# EAGLE design pcb (EAGLE 8.5.0)
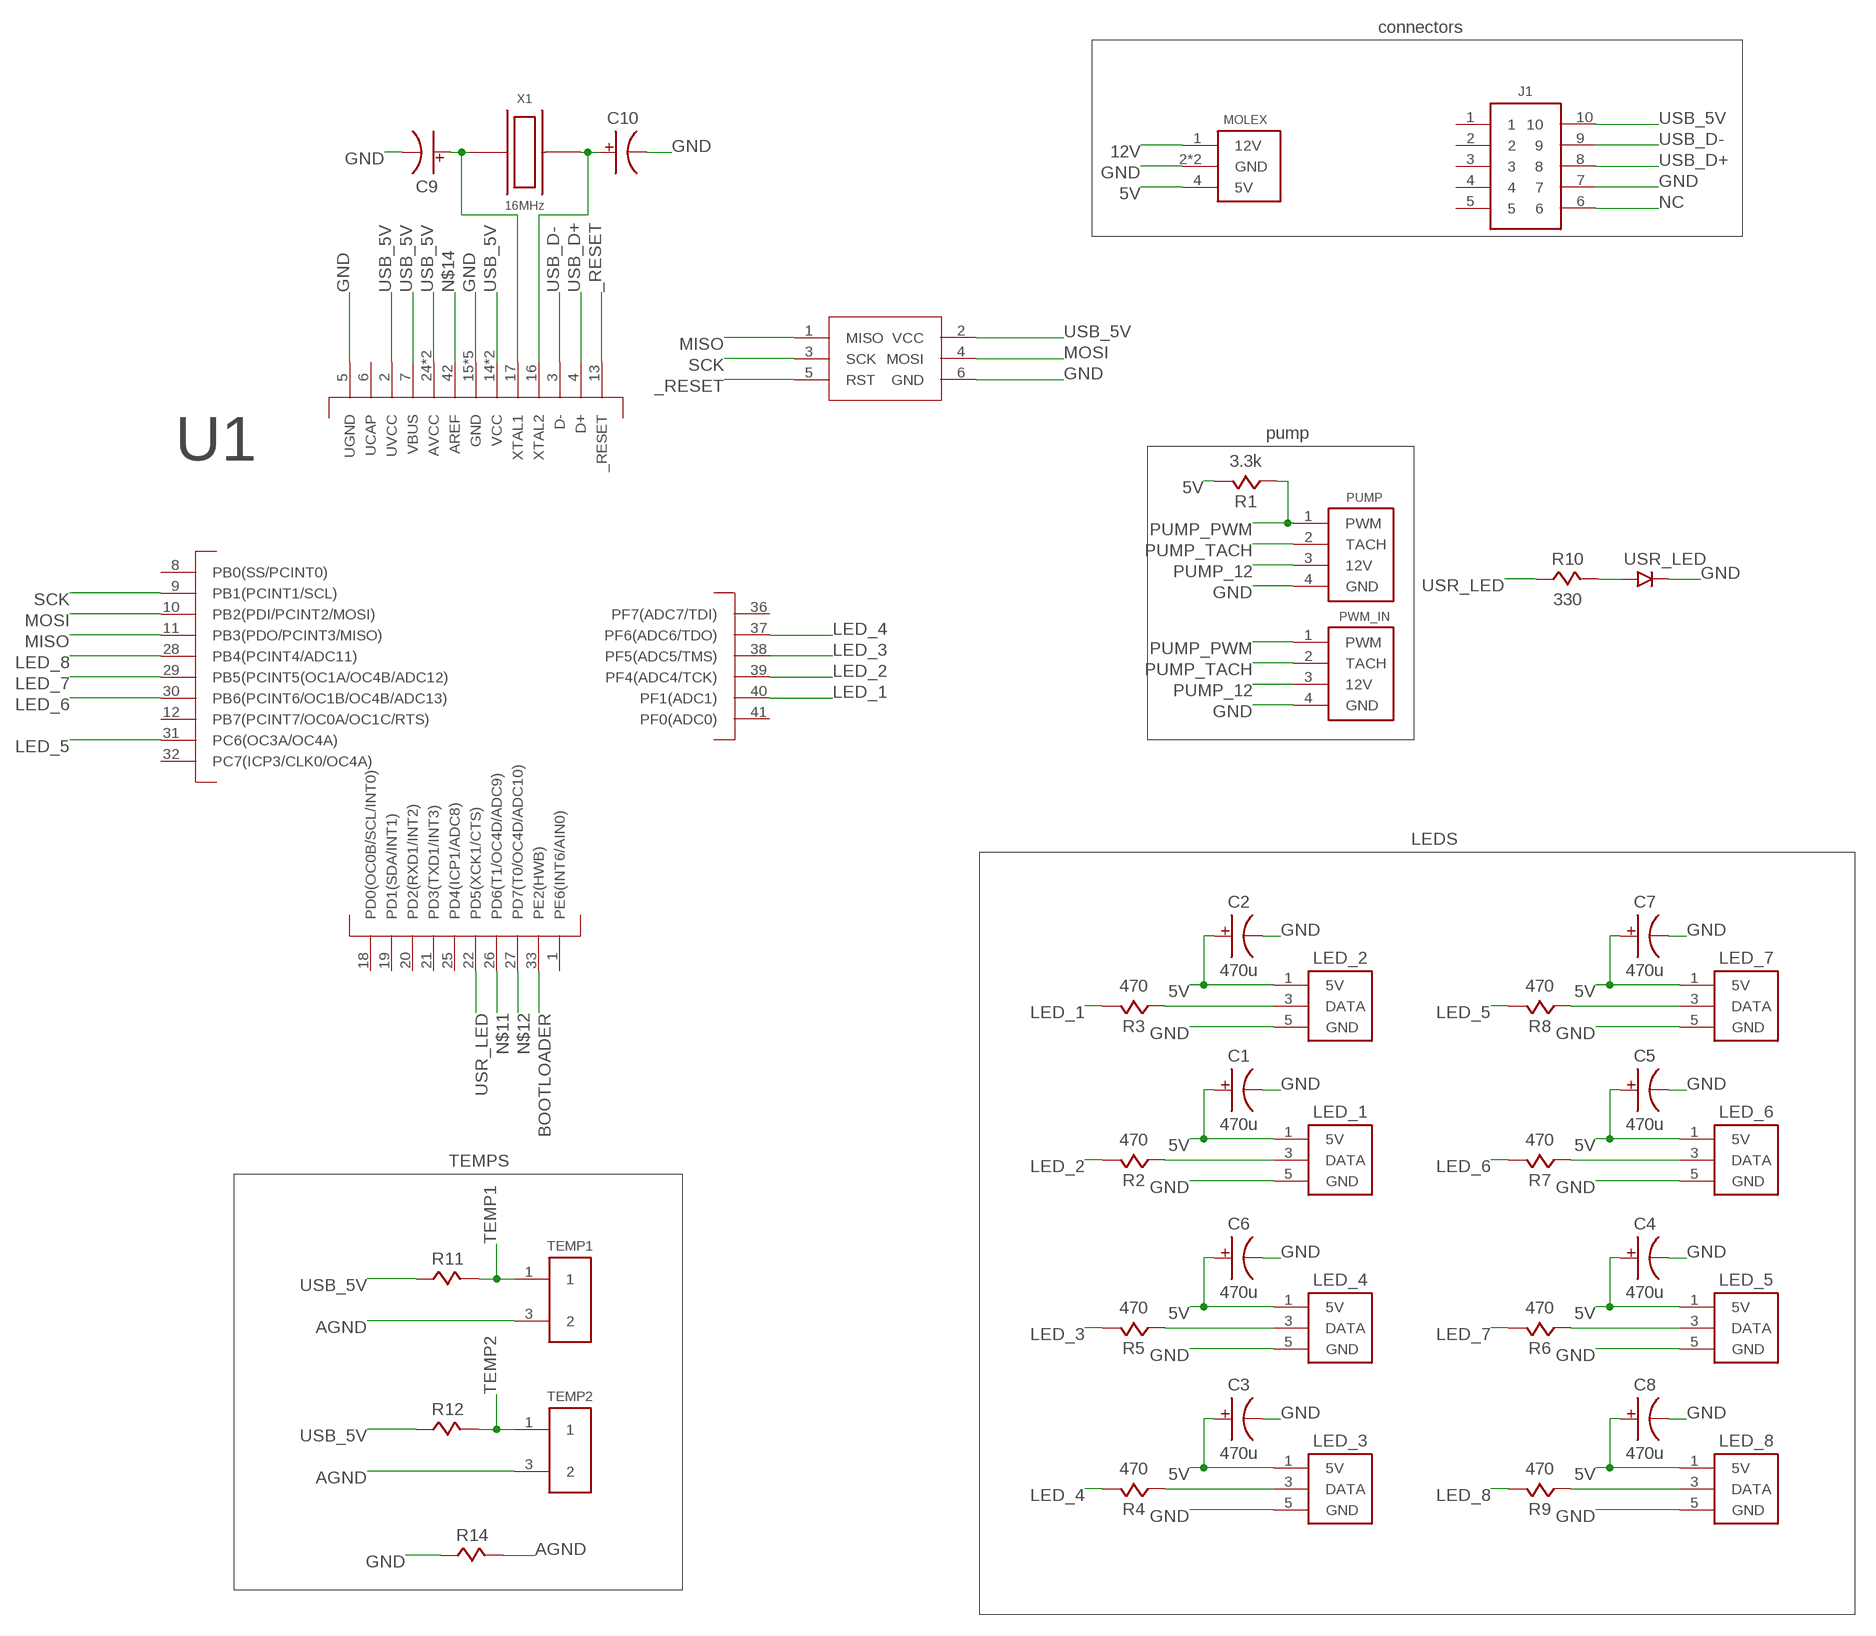
[diagram p0: schematic, sheet 1]

## Parts
C1  470u  CAPACITOR0805  [0805]
C2  470u  CAPACITOR0805  [0805]
C3  470u  CAPACITOR0805  [0805]
C4  470u  CAPACITOR0805  [0805]
C5  470u  CAPACITOR0805  [0805]
C6  470u  CAPACITOR0805  [0805]
C7  470u  CAPACITOR0805  [0805]
C8  470u  CAPACITOR0805  [0805]
C9  CAPACITOR0805  [0805]
C10  CAPACITOR0805  [0805]
J1  FEMALE_HEADER_5X2SMT  [5X2_HEADER_SMT]
J2  ISP_CONN_6PIN  [3X2_HEADER_SMT]
LED_1  WS2812B_3  [3X1_HEADER]
LED_2  WS2812B_3  [3X1_HEADER]
LED_3  WS2812B_3  [3X1_HEADER]
LED_4  WS2812B_3  [3X1_HEADER]
LED_5  WS2812B_3  [3X1_HEADER]
LED_6  WS2812B_3  [3X1_HEADER]
LED_7  WS2812B_3  [3X1_HEADER]
LED_8  WS2812B_3  [3X1_HEADER]
MOLEX  MOLEX_POWER  [MOLEX_POWER]
PUMP  4PIN_LED_HEADER  [4PIN_FAN_HEADER_THT]
PWM_IN  4PIN_LED_HEADER  [4PIN_FAN_HEADER_THT]
R1  3.3k  RESISTOR  [0805]
R2  470  RESISTOR  [0805]
R3  470  RESISTOR  [0805]
R4  470  RESISTOR  [0805]
R5  470  RESISTOR  [0805]
R6  470  RESISTOR  [0805]
R7  470  RESISTOR  [0805]
R8  470  RESISTOR  [0805]
R9  470  RESISTOR  [0805]
R10  330  RESISTOR  [0805]
R11  RESISTOR  [0805]
R12  RESISTOR  [0805]
R14  RESISTOR  [0805]
TEMP1  FEMALE_HEADER_2X1  [2X1_HEADER]
TEMP2  FEMALE_HEADER_2X1  [2X1_HEADER]
U1  ATMEGA32U4  [QFN44]
USR_LED  LED  [0805]
X1  16MHz  QUARTZ  [3.2X2.5_OSC]

## Nets
5V: C1.1 C2.1 C3.1 C4.1 C5.1 C6.1 C7.1 C8.1 LED_1.1(5V) LED_2.1(5V) LED_3.1(5V) LED_4.1(5V) LED_5.1(5V) LED_6.1(5V) LED_7.1(5V) LED_8.1(5V) MOLEX.4(5V) R1.2
12V: MOLEX.1(12V)
_RESET: J2.5(RST) U1.13(_RESET)
AGND: R14.2 TEMP1.3 TEMP2.3
BOOTLOADER: U1.33(PE2(HWB))
GND: C1.2 C2.2 C3.2 C4.2 C5.2 C6.2 C7.2 C8.2 C9.2 C10.2 J1.7 J2.6(GND) LED_1.5(GND) LED_2.5(GND) LED_3.5(GND) LED_4.5(GND) LED_5.5(GND) LED_6.5(GND) LED_7.5(GND) LED_8.5(GND) MOLEX.2(GND) MOLEX.3(GND) PUMP.4(GND) PWM_IN.4(GND) R14.1 U1.5(UGND) U1.15(GND) U1.23(GND) U1.35(GND) U1.43(GND) U1.45(GND) USR_LED.2
LED_1: R3.2 U1.40(PF1(ADC1))
LED_2: R2.2 U1.39(PF4(ADC4/TCK))
LED_3: R5.2 U1.38(PF5(ADC5/TMS))
LED_4: R4.2 U1.37(PF6(ADC6/TDO))
LED_5: R8.2 U1.31(PC6(OC3A/OC4A))
LED_6: R7.2 U1.30(PB6(PCINT6/OC1B/OC4B/ADC13))
LED_7: R6.2 U1.29(PB5(PCINT5(OC1A/OC4B/ADC12))
LED_8: R9.2 U1.28(PB4(PCINT4/ADC11))
MISO: J2.1(MISO) U1.11(PB3(PDO/PCINT3/MISO))
MOSI: J2.4(MOSI) U1.10(PB2(PDI/PCINT2/MOSI))
N$1: LED_1.3(DATA) R2.1
N$2: LED_2.3(DATA) R3.1
N$3: LED_3.3(DATA) R4.1
N$4: LED_4.3(DATA) R5.1
N$5: LED_5.3(DATA) R6.1
N$6: LED_6.3(DATA) R7.1
N$7: LED_7.3(DATA) R8.1
N$8: LED_8.3(DATA) R9.1
N$9: R10.2 USR_LED.1
N$10: C10.1 U1.16(XTAL2) X1.3
N$11: U1.26(PD6(T1/OC4D/ADC9))
N$12: U1.27(PD7(T0/OC4D/ADC10))
N$14: U1.42(AREF)
N$17: C9.1 U1.17(XTAL1) X1.1
NC: J1.6
PUMP_12: PUMP.3(12V) PWM_IN.3(12V)
PUMP_PWM: PUMP.1(PWM) PWM_IN.1(PWM) R1.1
PUMP_TACH: PUMP.2(TACH) PWM_IN.2(TACH)
SCK: J2.3(SCK) U1.9(PB1(PCINT1/SCL))
TEMP1: R11.2 TEMP1.1
TEMP2: R12.2 TEMP2.1
USB_5V: J1.10 J2.2(VCC) R11.1 R12.1 U1.2(UVCC) U1.7(VBUS) U1.14(VCC) U1.24(AVCC) U1.34(VCC) U1.44(AVCC)
USB_D+: J1.8 U1.4(D+)
USB_D-: J1.9 U1.3(D-)
USR_LED: R10.1 U1.22(PD5(XCK1/CTS))
Unconnected: J1.1 J1.2 J1.3 J1.4 J1.5 U1.1(PE6(INT6/AIN0)) U1.6(UCAP) U1.8(PB0(SS/PCINT0)) U1.12(PB7(PCINT7/OC0A/OC1C/RTS)) U1.18(PD0(OC0B/SCL/INT0)) U1.19(PD1(SDA/INT1)) U1.20(PD2(RXD1/INT2)) U1.21(PD3(TXD1/INT3)) U1.25(PD4(ICP1/ADC8)) U1.32(PC7(ICP3/CLK0/OC4A)) U1.36(PF7(ADC7/TDI)) U1.41(PF0(ADC0))

## Notes on the sheet
- connectors
- pump
- LEDS
- TEMPS

## Library data of the parts
C1-C10 = passive:CAPACITOR
J1 = connectors:FEMALE_HEADER_5X2
J2 = connectors:ISP_CONN_6PIN
LED_1-LED_8 = connectors:WS2812B_3
MOLEX = connectors:MOLEX_POWER
PUMP PWM_IN = connectors:4PIN_LED_HEADER
R1-R12 R14 = passive:RESISTOR
TEMP1 TEMP2 = connectors:FEMALE_HEADER_2X1
U1 = ic:ATMEGA32U4
USR_LED = opto:LED
X1 = passive:QUARTZ

## Board
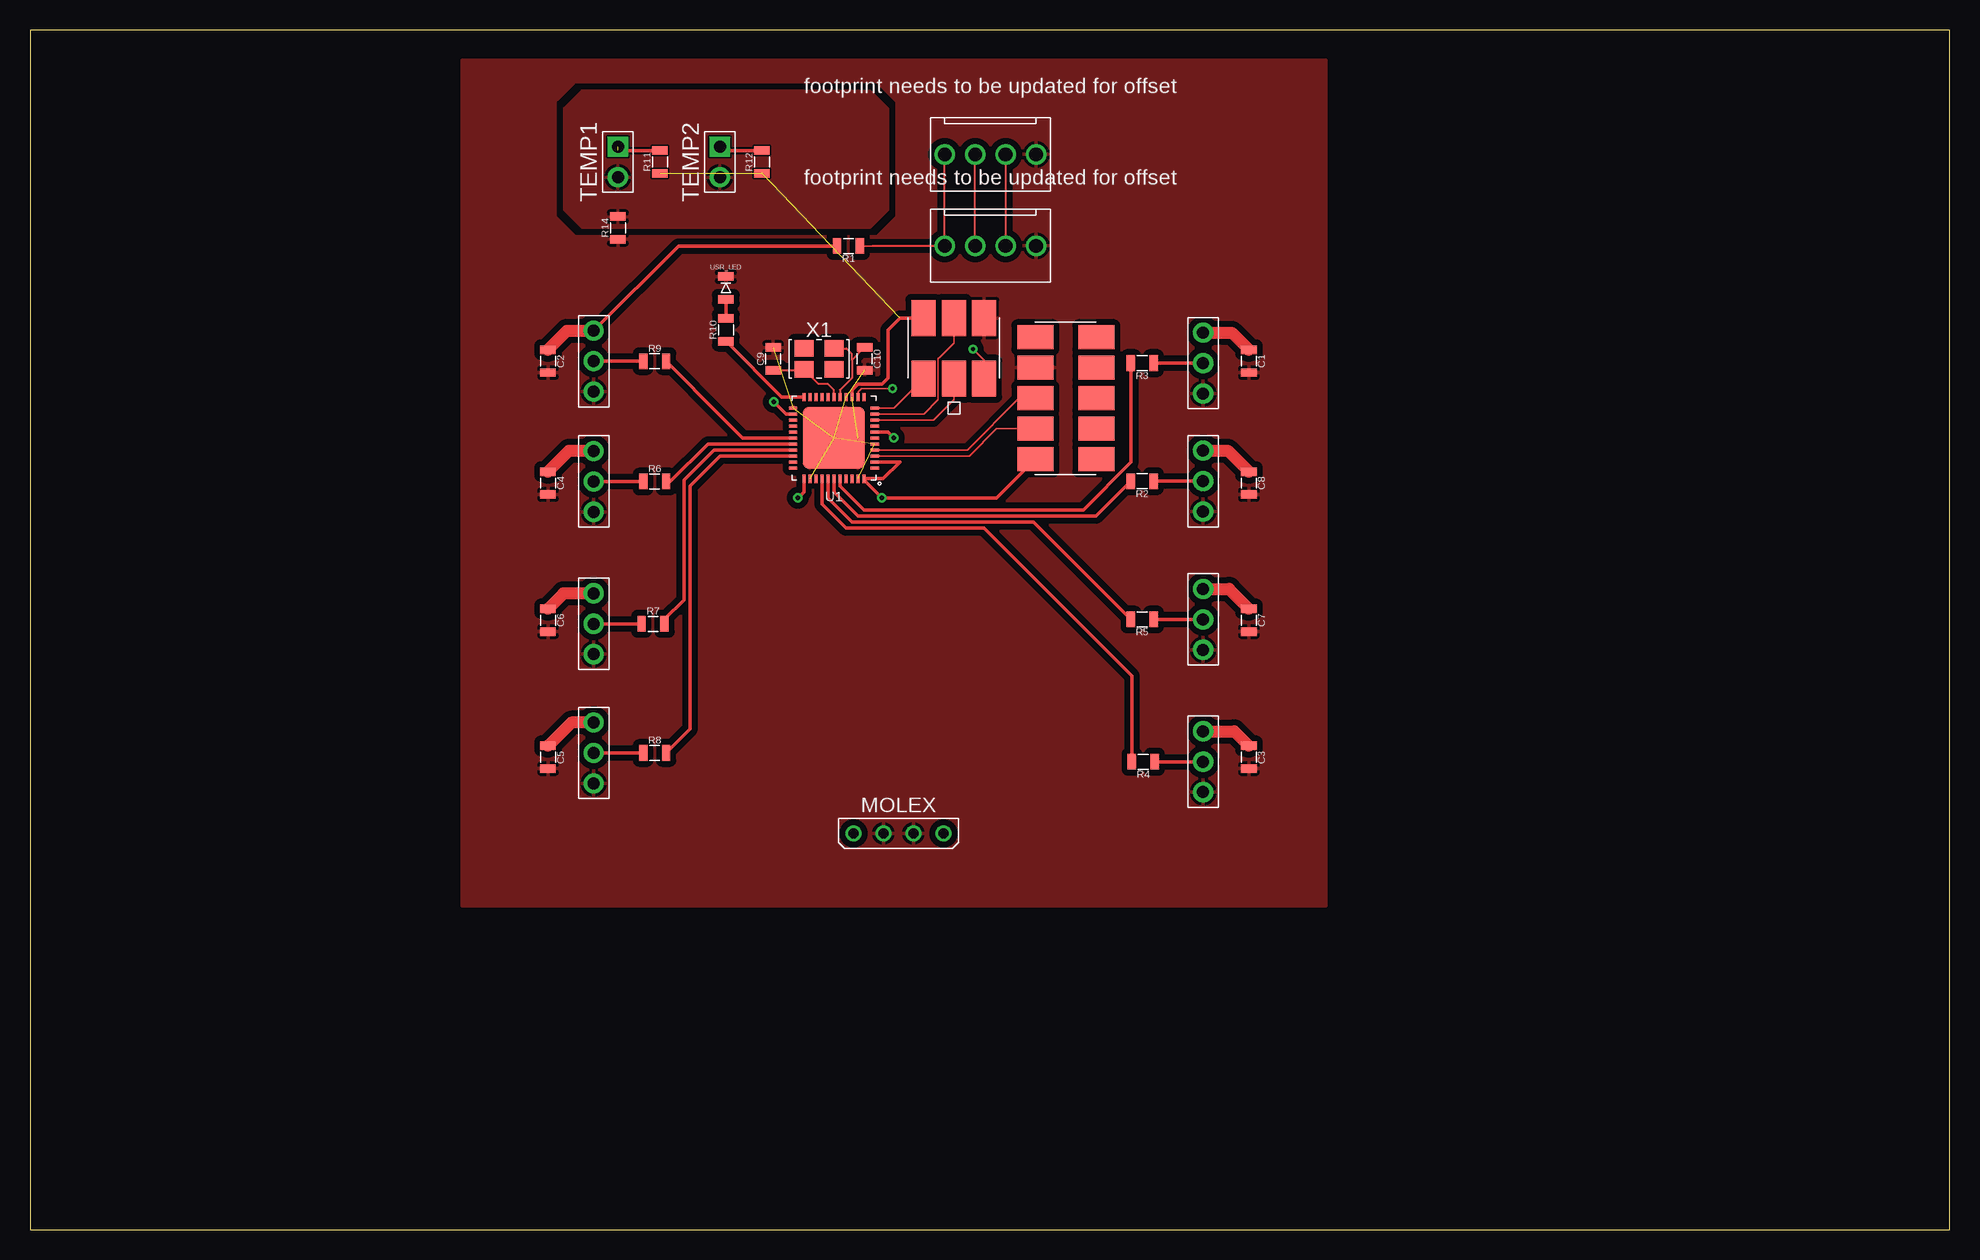
[diagram p1: board, top side]
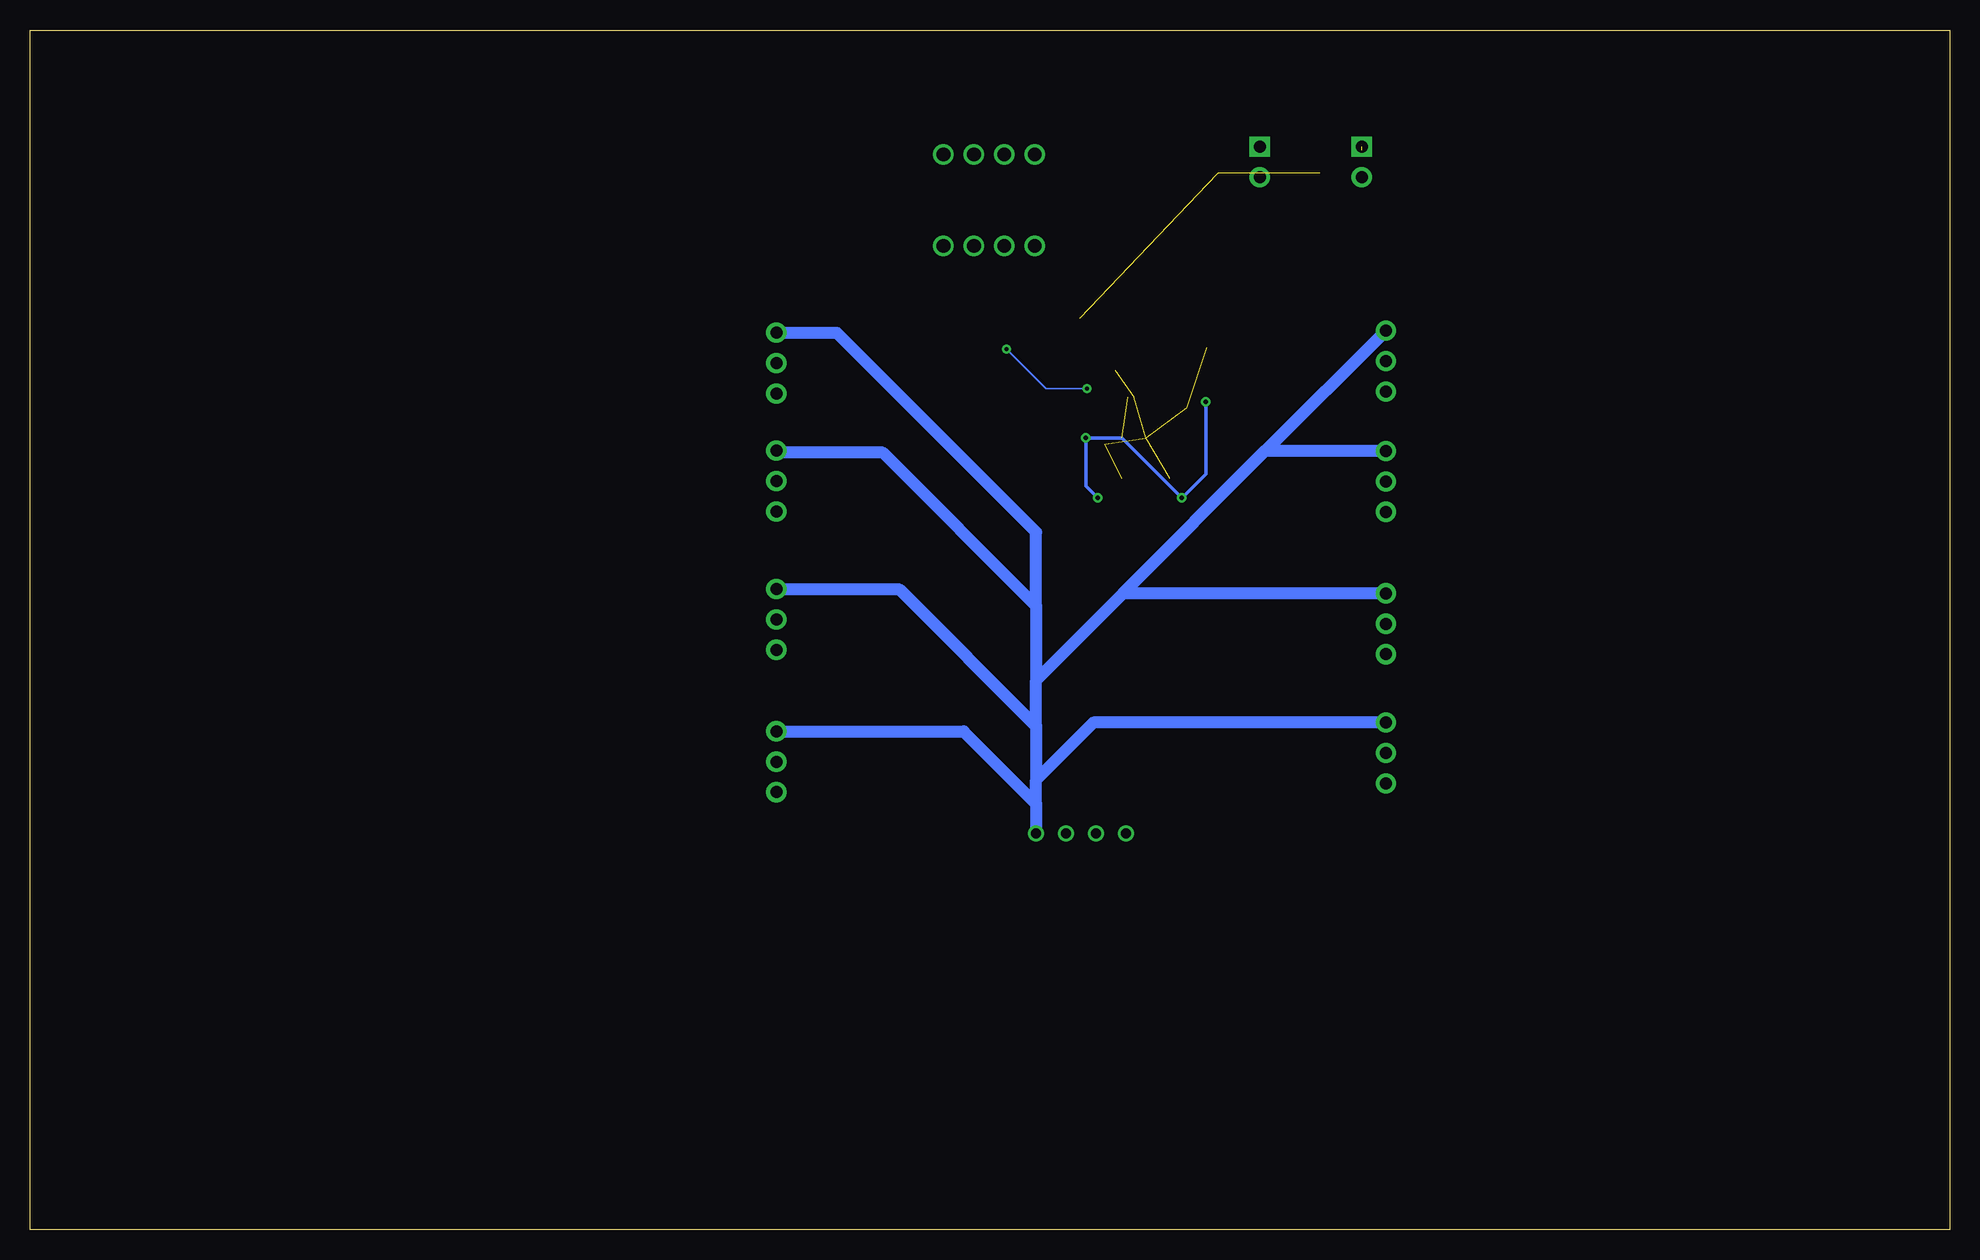
[diagram p2: board, bottom side, seen from below]

Size 160 x 100 mm. Coordinates in mm from the lower left corner, seen from the top.
Outline: 0,0 160,0 160,100 0,100 0,0
Copper layers (1*16): Top 0.035mm / dielectric 1.5mm / Bottom 0.035mm
Design rules "default": minimum track width 6mil, minimum drill 0.35mm, track to track 6mil, track to pad 6mil, pad to pad 6mil, via to via 6mil, smd to smd 6mil, copper to edge 40mil, drill to drill 6mil, minimum pad ring 10mil, minimum via ring 8mil, stop-mask expansion 4mil, vias tented up to drill 0mil, thermal gap 10mil

### Footprints (pad centres in the part's own frame; a part is rotated, then mirrored left to right if it is on the bottom)
0805 = smd 0.7 x 1.3: 1 -0.95,0; 2 0.95,0
5X2_HEADER_SMT = smd 2 x 3: 1 -5.08,-2.58; 2 -2.54,-2.58; 3 0,-2.58; 4 2.54,-2.58; 5 5.08,-2.58; 6 5.08,2.5; 7 2.54,2.5; 8 0,2.5; 9 -2.54,2.5; 10 -5.08,2.5
3X2_HEADER_SMT = smd 2 x 3: 1 -2.54,-2.58; 2 -2.54,2.5; 3 0,-2.58; 4 0,2.5; 5 2.54,-2.58; 6 2.54,2.5
3X1_HEADER = drill 1 pad 1.676: 1 0,2.54; 3 0,0; 5 0,-2.54
MOLEX_POWER = drill 0.85: 1 -3.75,0; 2 -1.25,0; 3 1.25,0; 4 3.75,0
4PIN_FAN_HEADER_THT = drill 1.14: 1 -3.81,0; 2 -1.27,0; 3 1.27,0; 4 3.81,0
2X1_HEADER = drill 1 pad 1.676 square: 1 0,1.27 | drill 1 pad 1.676: 3 0,-1.27
QFN44 = smd 0.7 x 0.25: 1 -3.4,2.5; 2 -3.4,2; 3 -3.4,1.5; 4 -3.4,1; 5 -3.4,0.5; 6 -3.4,0; 7 -3.4,-0.5; 8 -3.4,-1; 9 -3.4,-1.5; 10 -3.4,-2; 11 -3.4,-2.5; 23 3.4,-2.5; 24 3.4,-2; 25 3.4,-1.5; 26 3.4,-1; 27 3.4,-0.5; 28 3.4,0; 29 3.4,0.5; 30 3.4,1; 31 3.4,1.5; 32 3.4,2; 33 3.4,2.5 | smd 0.25 x 0.7: 12 -2.5,-3.4; 13 -2,-3.4; 14 -1.5,-3.4; 15 -1,-3.4; 16 -0.5,-3.4; 17 0,-3.4; 18 0.5,-3.4; 19 1,-3.4; 20 1.5,-3.4; 21 2,-3.4; 22 2.5,-3.4; 34 2.5,3.4; 35 2,3.4; 36 1.5,3.4; 37 1,3.4; 38 0.5,3.4; 39 0,3.4; 40 -0.5,3.4; 41 -1,3.4; 42 -1.5,3.4; 43 -2,3.4; 44 -2.5,3.4 | smd 5.12 x 5.12: 45 0,0
3.2X2.5_OSC = smd 1.6 x 1.4: 1 -1.25,-0.875; 2 1.25,-0.875; 3 1.25,0.875; 4 -1.25,0.875

### Placement (x,y rotation side)
C1  101.6,72.39 270 top
C2  43.18,72.39 270 top
C3  101.6,39.37 270 top
C4  43.18,62.23 270 top
C5  43.18,39.37 270 top
C6  43.18,50.8 270 top
C7  101.6,50.8 270 top
C8  101.6,62.23 270 top
C9  61.95,72.58 90 top
C10  69.57,72.58 270 top
J1  86.3,69.3 90 top
J2  77,73.5 0 top
LED_1  97.79,62.39 0 top
LED_2  97.79,72.23 0 top
LED_3  97.79,39 0 top
LED_4  97.79,50.87 0 top
LED_5  46.99,62.37 0 top
LED_6  46.99,50.5 0 top
LED_7  46.99,39.73 0 top
LED_8  46.99,72.39 0 top
MOLEX  72.39,33.02 0 top
PUMP  80.05,89.63 0 top
PWM_IN  80.05,82.01 0 top
R1  68.22,82 180 top
R2  92.71,62.39 180 top
R3  92.71,72.23 180 top
R4  92.79,39 180 top
R5  92.71,50.87 180 top
R6  52.07,62.37 0 top
R7  51.93,50.5 0 top
R8  52.07,39.73 0 top
R9  52.07,72.39 0 top
R10  58,75 90 top
R11  52.5,89 90 top
R12  61,89 90 top
R14  49,83.5 90 top
TEMP1  49,89 0 top
TEMP2  57.5,89 0 top
U1  67,66 180 top
USR_LED  58,78.5 90 top
X1  65.76,72.58 0 top

### Tracks (layer width: path | path; a pad name or v marks a point on that pad's centre or on a via)
5V
  Top 0.305: LED_8.1 54.06,82 R1.2
  Top 1: C2.1 44.77,74.93 LED_8.1 | LED_5.1 44.91,64.91 C4.1 | LED_6.1 44.47,53.04 C6.1 | LED_7.1 45.13,42.27 C5.1 | LED_4.1 99.94,53.41 C7.1 | LED_1.1 99.85,64.93 C8.1 | LED_2.1 100.17,74.77 C1.1 | LED_3.1 100.38,41.54 C3.1
  Bottom 1: 56.96,64.96 LED_8.1 | 68.88,53.04 56.96,64.96 | 68.88,53.04 76.14,45.78 | 76.14,42 76.14,37.5 | 76.14,42 76.14,45.78 | 76.14,35.5 76.14,37.5 | 76.14,35.5 MOLEX.4 | LED_5.1 56.91,64.91 56.96,64.96 | LED_6.1 68.88,53.04 | LED_7.1 71.37,42.27 76.14,37.5 | 76.14,52 76.14,45.78 | 76.14,52 76.14,58.14 92.77,74.77 LED_2.1 | 76.14,52 88.91,64.77 97.63,64.77 LED_1.1 | 76.14,42 87.48,53.34 97.72,53.34 LED_4.1 | LED_3.1 82.18,41.54 76.14,35.5
_RESET  (via drill 0.35)
  Top 0.127: U1.13 69,69.8 69.25,70.05 69.3,70.1 v71.9,70.1 | J2.5 79.54,72.46 v78.6,73.4
  Bottom 0.127: v78.6,73.4 75.3,70.1 v71.9,70.1
AGND
  pour Top: 46,95 70,95 71.5,93.5 71.5,85 70,83.5 46,83.5 44.5,85 44.5,93.5
GND  (7 unrouted)
  pour Top (isolate 0.5, rank 2): 36,97 36,27 108,27 108,97.5 36,97.5
LED_1
  Top 0.305: U1.40 67.5,62 69.5,60 87.8,60 91.76,63.96 R3.2
LED_2
  Top 0.305: R2.2 88.87,59.5 70.5,59.5 | 70.5,59.5 70,59.5 | U1.39 67,61.5 69,59.5 70.5,59.5
LED_3
  Top 0.305: R5.2 83.63,59 68.5,59 66.5,61 U1.38
LED_4
  Top 0.305: R4.2 91.84,46.16 79.5,58.5 68,58.5 66,60.5 U1.37
LED_5
  Top 0.305: R8.2 55,41.71 55,62 57.5,64.5 U1.31
LED_6
  Top 0.305: R7.2 52.88,50.88 54.5,52.5 54.5,62.5 57,65 U1.30
LED_7
  Top 0.305: R6.2 53.37,62.37 56.5,65.5 U1.29
LED_8
  Top 0.305: R9.2 57.7,67.7 57.91,67.5 59.41,66 U1.28
MISO
  Top 0.127: U1.11 72.04,68.5 J2.1
MOSI
  Top 0.127: U1.10 74.5,68 75.7,69.2 75.7,72.6 75.85,72.75 77,73.9 J2.4
N$1
  Top 0.305: R2.1 LED_1.3
N$2
  Top 0.305: LED_2.3 R3.1
N$3
  Top 0.305: R4.1 LED_3.3
N$4
  Top 0.305: R5.1 LED_4.3
N$5
  Top 0.305: LED_5.3 R6.1
N$6
  Top 0.305: LED_6.3 R7.1
N$7
  Top 0.305: R8.1 LED_7.3
N$8
  Top 0.305: LED_8.3 R9.1
N$9
  Top 0.305: USR_LED.1 R10.2
N$10
  Top 0.152: X1.3 68.05,73.45 68.5,73 68.5,72.5 | 68.5,72.5 68.5,71 67.5,70 U1.16 | C10.1 69.53,73.53 68.5,72.5
N$17
  Top 0.152: U1.17 67,70 66.5,70.5 65.72,70.5 X1.1 64.44,71.63 C9.1
PUMP_12
  Top 0.152: PUMP.3 PWM_IN.3
PUMP_PWM
  Top 0.152: PUMP.1 PWM_IN.1 70.21,82.01 R1.1
PUMP_TACH
  Top 0.152: PWM_IN.2 PUMP.2
SCK
  Top 0.127: U1.9 75.3,67.5 77,69.2 J2.3
TEMP1  (1 unrouted)
  Top 0.305: R11.2 49.05,89.95 49,90
TEMP2
  Top 0.305: TEMP2.1 57.82,89.95 R12.2
USB_5V  (via drill 0.35)  (3 unrouted)
  Top 0.305: U1.2 72.5,64 71.1,62.6 U1.44 69.5,62.5 v71,61 80.58,61 J1.10 | U1.24 63,68 v62,69 | U1.34 64.5,61.5 v64,61 | v72,66 71.5,66.5 U1.7 | U1.14 68.5,70 69,70.5 71,70.5 71.5,71 71.5,75 72.5,76 J2.2
  Bottom 0.305: v71,61 72,62 v72,66 69,66 v64,61 62,63 v62,69
USB_D+
  Top 0.127: U1.4 78.15,65 82.45,69.3 J1.8
USB_D-
  Top 0.127: J1.9 80.56,66.76 78.3,64.5 U1.3
USR_LED
  Top 0.305: R10.1 62.65,69.4 U1.22